# Altium schematic sheet +12_to_+5.SchDoc
size A; SheetNumber: 5; SheetTotal: 6
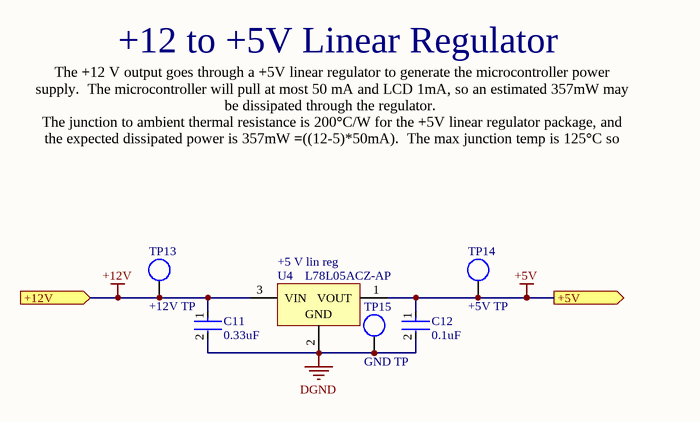
[diagram p0: +12_to_+5.SchDoc]

## Parts
C11  0.33uF  [FP-C0805C-DG-MFG]
C12  0.1uF  [FP-C0805C-DG-MFG]
TP13  +12V TP  [PCBComponent_1]
TP14  +5V TP  [PCBComponent_1]
TP15  GND TP  [PCBComponent_1]
U4  L78L05ACZ-AP  [TO-92]

## Ports
+5V (out), +12V (in)

## Nets
+5V: C12.1 TP14.TP U4.1(VOUT) ; port +5V
+12V: C11.1 TP13.TP U4.3(VIN) ; port +12V
DGND: C11.2 C12.2 TP15.TP U4.2(GND)

## Notes on the sheet
- +12 to +5V Linear Regulator
- The +12 V output goes through a +5V linear regulator to generate the microcontroller power supply.  The microcontroller will pull at most 50 mA and LCD 1mA, so an estimated 357mW may be dissipated through the regulator.
  The junction to ambient thermal resistance is 200°C/W for the +5V linear regulator package, and the expected dissipated power is 357mW =((12-5)*50mA).  The max junction temp is 125°C so the dissipation will cause 71.4°C, acceptable for the IC.
- (near U4) +5 V lin reg

## Library data of the parts
C11 C12 = CMP-2007-03243-2: CAP CER 10UF 10V X5R 0805; Manufacturer Part Number: C0805C106K8PACTU; Manufacturer: Kemet; 3DS Part Number: 220-00001; Tolerance: 10%; Temperature Coefficient: 15%; Material: Ceramic; Device Class L2: Capacitors; Device Class L1: Passive Components; ComponentLink2URL: https://content.kemet.com/datasheets/KEM_C1006_X5R_SMD.pdf; Height: 1.4mm; Lead Free: Yes; Digikey Description: CAP CER 10UF 10V X5R 0805; Octopart: https://octopart.com/c0805c106k8pactu-kemet-98697; Capacitance: 10uF; Value: 10uF; Temperature Range Low: -55°C; Temperature: -55°C to +85°C; Automotive: No; Mouser Description: CAP CER 10UF 10V X5R 0805; Ipc Land Pattern Name: CAPC200125X125; Temperature Range High: +85°C; Voltage: 10V; RoHS: TRUE; Device Class L3: Ceramic Capacitors; ComponentLink2Description: Datasheet; Voltage Rating: 10V; Package: C0805C-DG; Temperature Characteristic: X5R; Category: Cap
TP13-TP15 = Component_1
U4 = CMP-0244-00019-1: Positive Voltage Regulator, 5V, 3-Pin TO-92; DatasheetVersion: 1/02/2011; ComponentLink1URL: http://www.st.com; PackageDescription: TO, Flat Index; 3 In-Line, Axial Leads; Body Dia. 4.7mm; Lead Dia. 0.56 mm (max); PackageReference: TO-92; ComponentLink2Description: Datasheet; ComponentLink2URL: http://www.st.com/internet/com/TECHNICAL_RESOURCES/TECHNICAL_LITERATURE/DATASHEET/CD00000446.pdf; ComponentLink1Description: Manufacturer URL; PackageVersion: 2011